# Altium schematic sheet Vesta_cape_wifi.SchDoc
size A3
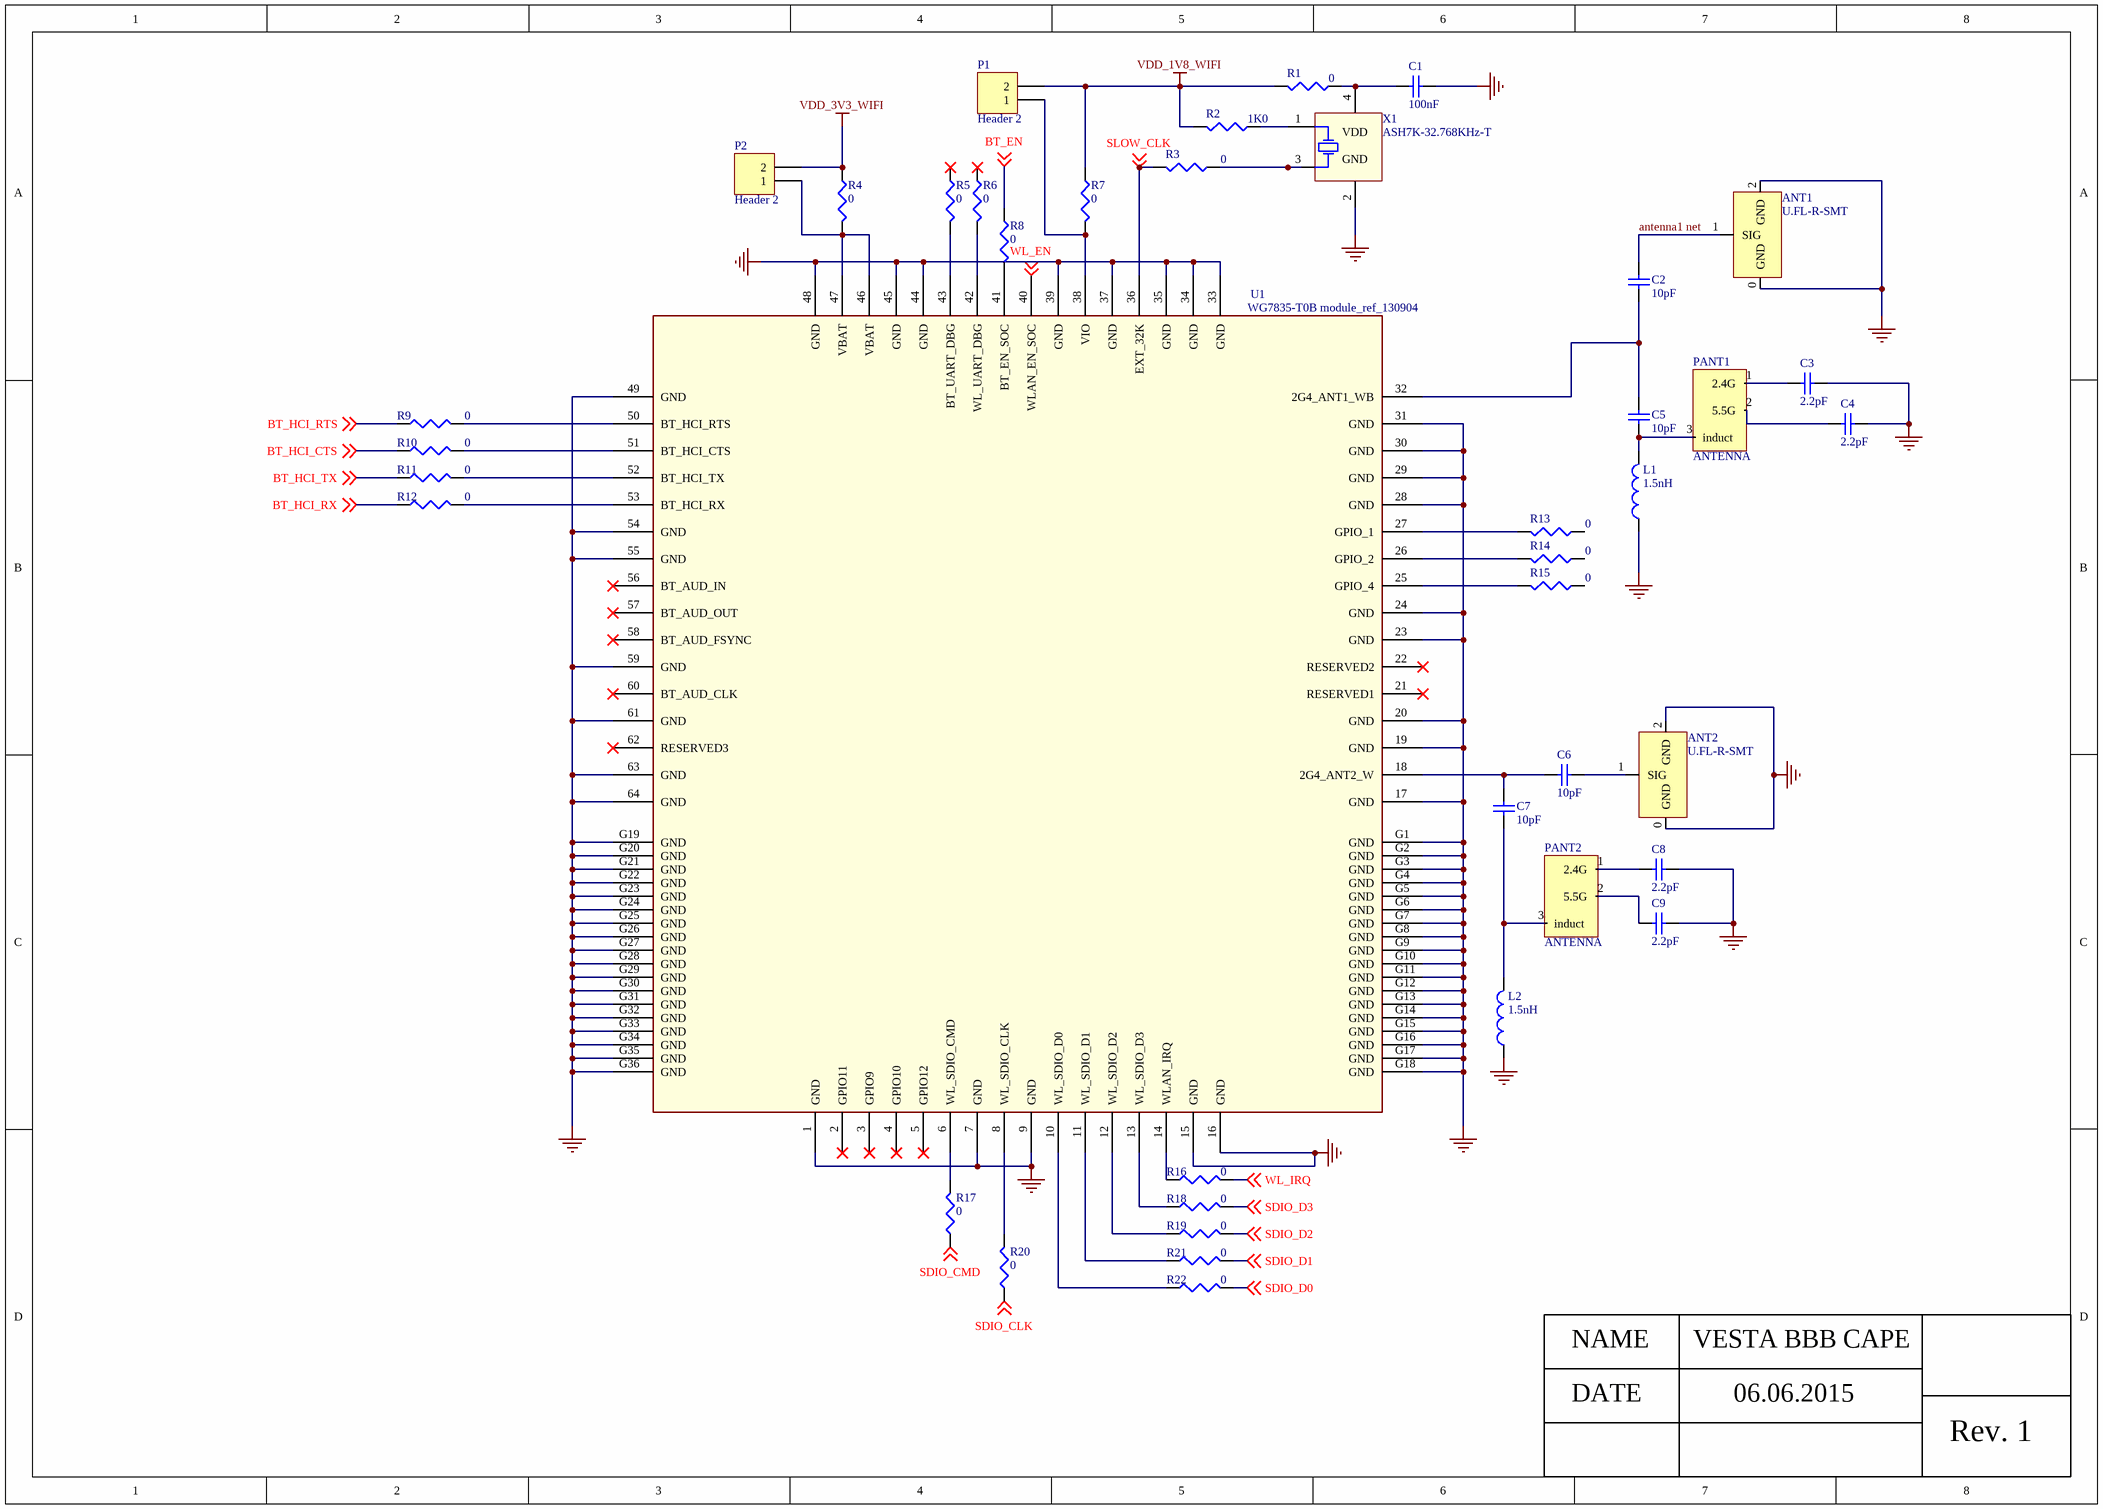
[diagram p0: Vesta_cape_wifi.SchDoc]

## Parts
ANT1  U.FL-R-SMT  [U.FL-R-SMT]
ANT2  U.FL-R-SMT  [U.FL-R-SMT]
C1  100nF  [C1206]
C2  10pF  [Capacitor_0603]
C3  2.2pF  [Capacitor_0603]
C4  2.2pF  [Capacitor_0603]
C5  10pF  [Capacitor_0603]
C6  10pF  [Capacitor_0603]
C7  10pF  [Capacitor_0603]
C8  2.2pF  [Capacitor_0603]
C9  2.2pF  [Capacitor_0603]
L1  1.5nH  [0402-A]
L2  1.5nH  [0402-A]
P1  Header 2  [HDR1X2]
P2  Header 2  [HDR1X2]
PANT1  ANTENNA  [ANT_BRD_CUT]
PANT2  ANTENNA  [ANT_BRD_CUT]
R1  0  [J1-0603]
R2  1K0  [J1-0603]
R3  0  [J1-0603]
R4  0  [J1-0603]
R5  0  [J1-0603]
R6  0  [J1-0603]
R7  0  [J1-0603]
R8  0  [J1-0603]
R9  0  [J1-0603]
R10  0  [J1-0603]
R11  0  [J1-0603]
R12  0  [J1-0603]
R13  0  [J1-0603]
R14  0  [J1-0603]
R15  0  [J1-0603]
R16  0  [J1-0603]
R17  0  [J1-0603]
R18  0  [J1-0603]
R19  0  [J1-0603]
R20  0  [J1-0603]
R21  0  [J1-0603]
R22  0  [J1-0603]
U1  WG7835-T0B module_ref_130904  [E-13.4X13.3-N100_0.75-TOP]
X1  ASH7K-32.768KHz-T  [ABRA-ASH7K-4_V]

## Nets
GND: ANT1.0(GND) ANT1.2(GND) ANT2.0(GND) ANT2.2(GND) C1.1 C3.2 C4.2 C8.2 C9.2 L1.1 L2.1 U1.1(GND) U1.7(GND) U1.9(GND) U1.15(GND) U1.16(GND) U1.17(GND) U1.19(GND) U1.20(GND) U1.23(GND) U1.24(GND) U1.28(GND) U1.29(GND) U1.30(GND) U1.31(GND) U1.33(GND) U1.34(GND) U1.35(GND) U1.37(GND) U1.39(GND) U1.44(GND) U1.45(GND) U1.48(GND) U1.49(GND) U1.54(GND) U1.55(GND) U1.59(GND) U1.61(GND) U1.63(GND) U1.64(GND) U1.G1(GND) U1.G2(GND) U1.G3(GND) U1.G4(GND) U1.G5(GND) U1.G6(GND) U1.G7(GND) U1.G8(GND) U1.G9(GND) U1.G10(GND) U1.G11(GND) U1.G12(GND) U1.G13(GND) U1.G14(GND) U1.G15(GND) U1.G16(GND) U1.G17(GND) U1.G18(GND) U1.G19(GND) U1.G20(GND) U1.G21(GND) U1.G22(GND) U1.G23(GND) U1.G24(GND) U1.G25(GND) U1.G26(GND) U1.G27(GND) U1.G28(GND) U1.G29(GND) U1.G30(GND) U1.G31(GND) U1.G32(GND) U1.G33(GND) U1.G34(GND) U1.G35(GND) U1.G36(GND) X1.2(GND)
VDD_1V8_WIFI: P1.2 R1.2 R2.2 R7.1
VDD_3V3_WIFI: P2.2 R4.1
antenna1 net: ANT1.1(SIG) C2.2
BT_EN: R8.1 ; off-sheet BT_EN
BT_HCI_CTS: R10.1 ; off-sheet BT_HCI_CTS
BT_HCI_RTS: R9.1 ; off-sheet BT_HCI_RTS
BT_HCI_RX: R12.1 ; off-sheet BT_HCI_RX
BT_HCI_TX: R11.1 ; off-sheet BT_HCI_TX
SDIO_CLK: R20.1 ; off-sheet SDIO_CLK
SDIO_CMD: R17.1 ; off-sheet SDIO_CMD
SDIO_D0: R22.2 ; off-sheet SDIO_D0
SDIO_D1: R21.2 ; off-sheet SDIO_D1
SDIO_D2: R19.2 ; off-sheet SDIO_D2
SDIO_D3: R18.2 ; off-sheet SDIO_D3
SLOW_CLK: R3.2 U1.36(EXT_32K) ; off-sheet SLOW_CLK
WL_EN: U1.40(WLAN_EN_SOC) ; off-sheet WL_EN
WL_IRQ: R16.2 ; off-sheet WL_IRQ
NetANT2_1: ANT2.1(SIG) C6.2
NetC1_2: C1.2 R1.1 X1.4(VDD)
NetC2_1: C2.1 C5.2 U1.32(2G4_ANT1_WB)
NetC3_1: C3.1 PANT1.1(2.4G)
NetC4_1: C4.1 PANT1.2(5.5G)
NetC5_1: C5.1 L1.2 PANT1.3(induct)
NetC6_1: C6.1 C7.2 U1.18(2G4_ANT2_W)
NetC7_1: C7.1 L2.2 PANT2.3(induct)
NetC8_1: C8.1 PANT2.1(2.4G)
NetC9_1: C9.1 PANT2.2(5.5G)
NetP1_1: P1.1 R7.2 U1.38(VIO)
NetP2_1: P2.1 R4.2 U1.46(VBAT) U1.47(VBAT)
NetR2_1: R2.1 X1.1(VIO)
NetR3_1: R3.1 X1.3(Output)
NetR5_2: R5.2 U1.43(BT_UART_DBG)
NetR6_2: R6.2 U1.42(WL_UART_DBG)
NetR8_2: R8.2 U1.41(BT_EN_SOC)
NetR9_2: R9.2 U1.50(BT_HCI_RTS)
NetR10_2: R10.2 U1.51(BT_HCI_CTS)
NetR11_2: R11.2 U1.52(BT_HCI_TX)
NetR12_2: R12.2 U1.53(BT_HCI_RX)
NetR13_2: R13.2 U1.27(GPIO_1)
NetR14_2: R14.2 U1.26(GPIO_2)
NetR15_2: R15.2 U1.25(GPIO_4)
NetR16_1: R16.1 U1.14(WLAN_IRQ)
NetR17_2: R17.2 U1.6(WL_SDIO_CMD)
NetR18_1: R18.1 U1.13(WL_SDIO_D3)
NetR19_1: R19.1 U1.12(WL_SDIO_D2)
NetR20_2: R20.2 U1.8(WL_SDIO_CLK)
NetR21_1: R21.1 U1.11(WL_SDIO_D1)
NetR22_1: R22.1 U1.10(WL_SDIO_D0)

Not connected (* = marked no-connect by the designer): R5 1*; R6 1*; R13 1; R14 1; R15 1; U1 2(GPIO11)* 3(GPIO9)* 4(GPIO10)* 5(GPIO12)* 21(RESERVED1)* 22(RESERVED2)* 56(BT_AUD_IN)* 57(BT_AUD_OUT)* 58(BT_AUD_FSYNC)* 60(BT_AUD_CLK)* 62(RESERVED3)*

## Notes on the sheet
- NAME
- VESTA BBB CAPE
- DATE
- 06.06.2015
- Rev. 1

## Library data of the parts
ANT1 ANT2 = U.FL-R-SMT: pin to pad: 0>2
C1 C2 C4-C7 C9 = Cap Semi: Capacitor (Semiconductor SIM Model); Published: 8-Jun-2000; LatestRevisionDate: 29-May-2009; LatestRevisionNote: IPC-7351 Footprint Added.; PackageReference: C1206; Publisher: Altium Limited; PackageDescription: Chip Capacitor
  C1: Value: 100nF
  C2 C5-C7: Value: 10pF
  C4 C9: Value: 2.2pF
C3 C8 = Cap Semi: Capacitor (Semiconductor SIM Model); Value: 100pF; Published: 8-Jun-2000; LatestRevisionDate: 29-May-2009; LatestRevisionNote: IPC-7351 Footprint Added.; PackageReference: C1206; Publisher: Altium Limited; PackageDescription: Chip Capacitor
L1 L2 = Inductor: Code_IEC: 1005; Value: 1.5nHH; Published: 8-Jun-2000; LatestRevisionDate: 29-May-2009; LatestRevisionNote: IPC-7351 Footprint Added.; PackageReference: 0402-A; Publisher: Altium Limited; PackageDescription: Chip Inductor; Code_JEITA: 0402
P1 P2 = Header 2: Header, 2-Pin; LatestRevisionDate: 17-Jul-2002; LatestRevisionNote: Re-released for DXP Platform.; Publisher: Altium Limited
R1-R22 = Res3: Resistor; Value: 1K; Published: 8-Jun-2000; LatestRevisionDate: 29-May-2009; LatestRevisionNote: IPC-7351 Footprint Added.; PackageReference: J1-0603; Publisher: Altium Limited; PackageDescription: Chip Resistor
X1 = CMP-0448-00001-2: Crystal Oscillator, 32.768 kHz, -40 to 80 degC, 3.2 x 1.5 x 1.0 mm SMD, Tape and Reel; Manufacturer: Abracon; Start-up Time (Max): 0.6 s; Vdd Current Consumption (Max): 0.7 uA; Fall Time (Max): 50 ns; Disable Delay Time (Max): 1 us; Supply Voltage Range (VIO): 1.5 to 36 V; Output Load (CMOS): 15 pF; VIO Current Consumption (Max): 3.5 uA; Frequency Tolerance: -18 to 28 ppm; ComponentLink3URL: http://www.abracon.com/Oscillators/ASH7K.pdf; PackageReference: ASH7K-4; ComponentLink1Description: Manufacturer URL; Mounting Technology: Surface Mount; PackageDescription: 4-Pin Hand Drawn, Body 3.2x1.5mm; ComponentLink2URL: http://www.abracon.com/Oscillators/ASH7K.pdf; ComponentLink2Description: Datasheet; PartNumber: ASH7K-32.768KHz-T; ComponentLink1URL: http://www.abracon.com/; Rise Time(Max): 50 ns; DatasheetVersion: 12.27.11; Packing: Tape and Reel; ComponentLink3Description: Package Specification; Supply Voltage Range (Vdd): 1.5 to 36 V; Frequency: 32.768 kHz; Operating Temperature: -40 to 85 degC